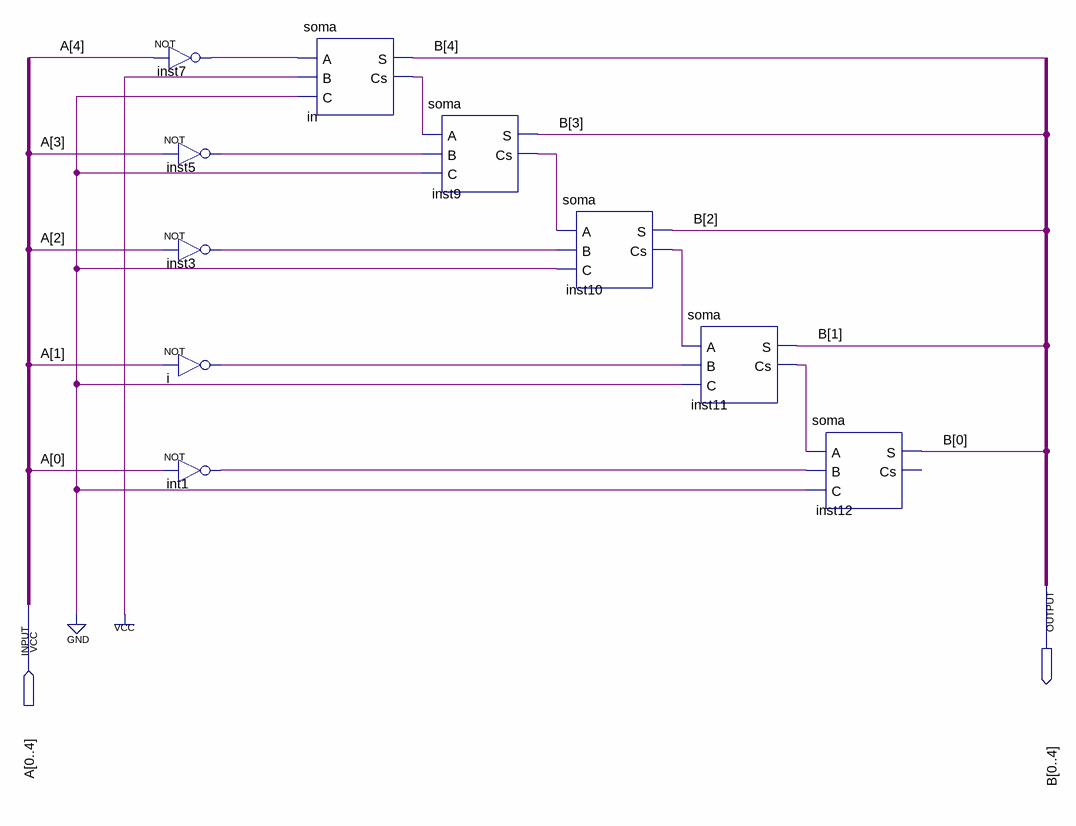
[diagram p0: schematic sheet]
// Quartus schematic comple2.bdf as structural Verilog: 10 symbols, 2 pins
module comple2 (
  input  [0:4] A,
  output [0:4] B
);

  wire i_out, in_cs, inst3_out, inst5_out, inst7_out, inst9_cs, inst10_cs, inst11_cs, int1_out;

  not inst7 (inst7_out, A[4]);
  not inst5 (inst5_out, A[3]);
  not inst3 (inst3_out, A[2]);
  not i (i_out, A[1]);
  not int1 (int1_out, A[0]);
  soma in (.A(inst7_out), .B(1'b1), .C(1'b0), .S(B[4]), .Cs(in_cs));
  soma inst9 (.A(in_cs), .B(inst5_out), .C(1'b0), .S(B[3]), .Cs(inst9_cs));
  soma inst10 (.A(inst9_cs), .B(inst3_out), .C(1'b0), .S(B[2]), .Cs(inst10_cs));
  soma inst11 (.A(inst10_cs), .B(i_out), .C(1'b0), .S(B[1]), .Cs(inst11_cs));
  soma inst12 (.A(inst11_cs), .B(int1_out), .C(1'b0), .S(B[0]));  // open: Cs
endmodule
